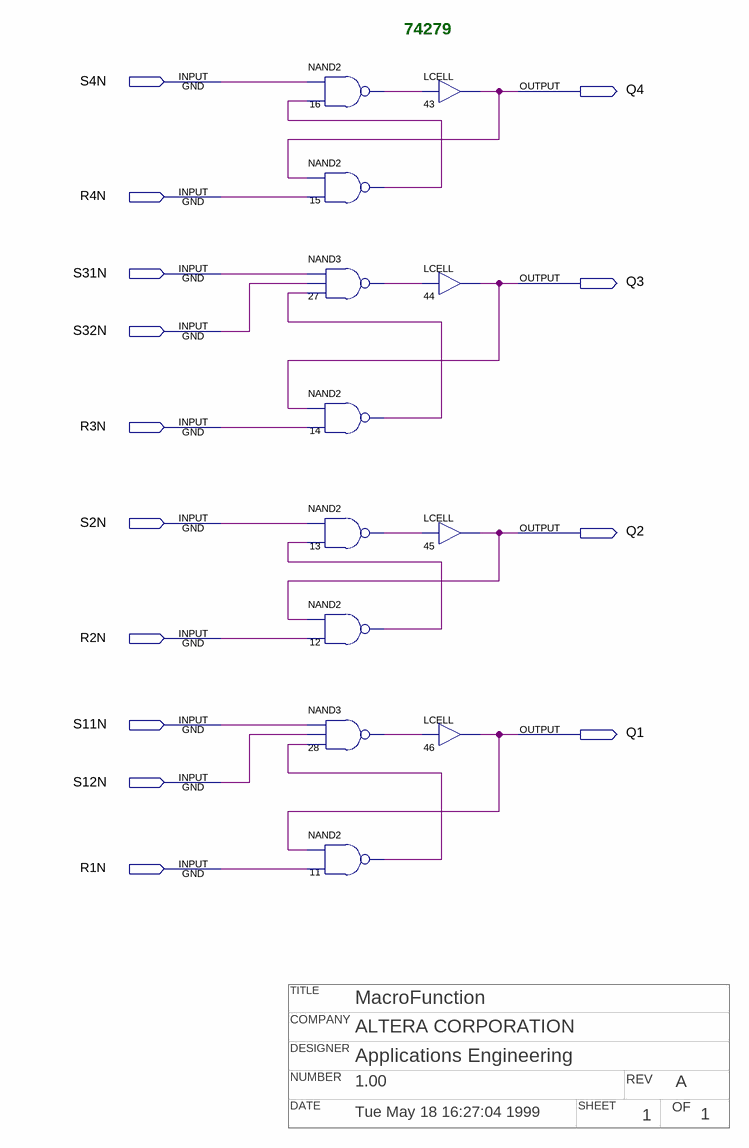
[diagram p0: schematic sheet]
// Quartus schematic 74279.bdf as structural Verilog: 12 symbols, 14 pins
// Title block: TITLE: MacroFunction; COMPANY: ALTERA CORPORATION; DESIGNER: Applications Engineering; NUMBER: 1.00; REV: A; DATE: Tue May 18 16:27:04 1999; SHEET: 1; OF: 1
module \74279  (
  input  S4N,
  input  R4N,
  input  S31N,
  input  S32N,
  input  R3N,
  input  S2N,
  input  R2N,
  input  S11N,
  input  S12N,
  input  R1N,
  output Q4,
  output Q3,
  output Q2,
  output Q1
);

  wire n11_out, n12_out, n13_out, n14_out, n15_out, n16_out, n27_out, n28_out;

  nand u_16 (n16_out, S4N, n15_out);
  nand u_15 (n15_out, Q4, R4N);
  nand u_27 (n27_out, S31N, S32N, n14_out);
  nand u_14 (n14_out, Q3, R3N);
  nand u_13 (n13_out, S2N, n12_out);
  nand u_12 (n12_out, Q2, R2N);
  nand u_28 (n28_out, S11N, S12N, n11_out);
  nand u_11 (n11_out, Q1, R1N);
  LCELL u_43 (.IN(n16_out), .OUT(Q4));
  LCELL u_44 (.IN(n27_out), .OUT(Q3));
  LCELL u_45 (.IN(n13_out), .OUT(Q2));
  LCELL u_46 (.IN(n28_out), .OUT(Q1));

  // Notes on the sheet:
  //   74279
endmodule
